# EAGLE design Breakout_14Pin (EAGLE 9.6.2)
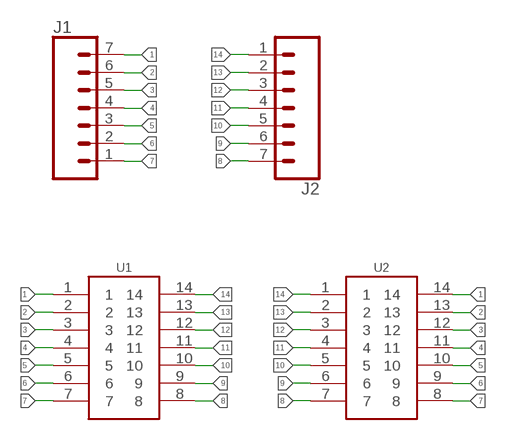
[diagram p0: schematic, sheet 1]

## Parts
J1  CONN_07  [1X07]
J2  CONN_07  [1X07]
U1  GEN_14SOIC  [SO14]
U2  GEN_14TSSOP  [TSSOP14]

## Nets
1: J1.7 U1.1 U2.14
2: J1.6 U1.2 U2.13
3: J1.5 U1.3 U2.12
4: J1.4 U1.4 U2.11
5: J1.3 U1.5 U2.10
6: J1.2 U1.6 U2.9
7: J1.1 U1.7 U2.8
8: J2.7 U1.8 U2.7
9: J2.6 U1.9 U2.6
10: J2.5 U1.10 U2.5
11: J2.4 U1.11 U2.4
12: J2.3 U1.12 U2.3
13: J2.2 U1.13 U2.2
14: J2.1 U1.14 U2.1

## Library data of the parts
J1 J2 = bschulz:CONN_07: Multi connection point. Often used as Generic Header-pin footprint for 0.1 inch spaced/style header connections On any of the 0.1 inch spaced packages, you can populate with these: Break Away Headers - Straight <https://www.sparkfun.com/products/116> (PRT-00116) Break Away Male Headers - Right Angle <https://www.sparkfun.com/products/553> (PRT-00553) Female Headers <https://www.sparkfun.com/products/115> (PRT-00115) Break Away Headers - Machine Pin <https://www.sparkfun.com/products/117> (PRT-00117) Break Away Female Headers - Swiss Machine Pin <https://www.sparkfun.com/products/743> (PRT-00743) For SCREWTERMINALS and SPRING TERMINALS visit here: Screw Terimnals on SparkFun.com <https://www.sparkfun.com/search/results?term=Screw+Terminals> (5mm/3.5mm/2.54mm spacing) This device is also useful as a general connection point to wire up your design to another part of your project. Our various solder wires solder well into these plated through hole pads. Hook-Up Wire - Assortment (Stranded, 22 AWG) <https://www.sparkfun.com/products/11375> (PRT-11375) Hook-Up Wire - Assortment (Solid Core, 22 AWG) <https://www.sparkfun.com/products/11367> (PRT-11367) View the entire wire category on our website here <https://www.sparkfun.com/categories/141> Special notes: Molex polarized connector foot print use with SKU : PRT-08231 with associated crimp pins and housings. 1MM SMD Version SKU: PRT-10208 NOTES ON THE VARIANTS LOCK and LOCK_LONGPADS... This footprint was designed to help hold the alignment of a through-hole component (i.e. 6-pin header) while soldering it into place. You may notice that each hole has been shifted either up or down by 0.005 of an inch from it's more standard position (which is a perfectly straight line). This slight alteration caused the pins (the squares in the middle) to touch the edges of the holes. Because they are alternating, it causes a "brace" to hold the component in place. 0.005 has proven to be the perfect amount of "off-center" position when using our standard breakaway headers. Although looks a little odd when you look at the bare footprint, once you have a header in there, the alteration is very hard to notice. Also,if you push a header all the way into place, it is covered up entirely on the bottom side.
U1 U2 = bschulz:GEN_14: Generic 14 Pin Package for Breakout Boards

## Board
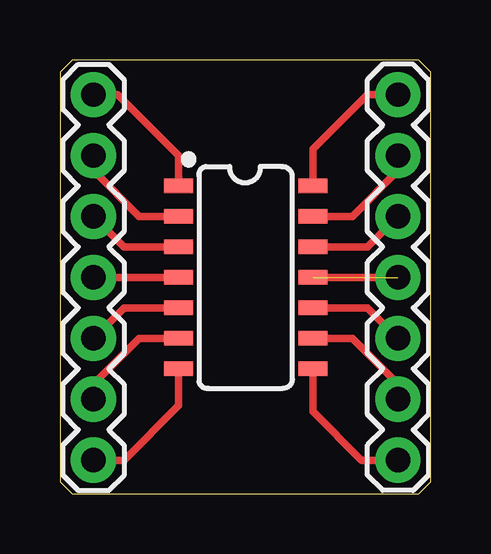
[diagram p1: board, top side]
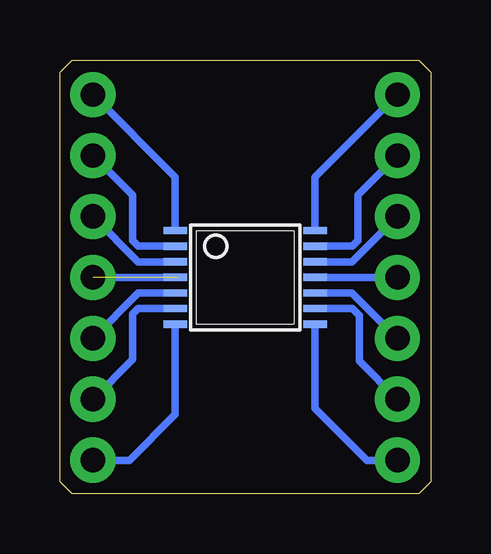
[diagram p2: board, bottom side, seen from below]

Size 15.47 x 18.09 mm. Coordinates in mm from the lower left corner, seen from the top.
Outline: 0,17.59 0,0.5 0.5,0 14.97,0 15.47,0.5 15.47,17.59 14.97,18.09 0.5,18.09 0,17.59
Copper layers (1*16): Top 0.035559375mm / dielectric 1.6mm / Bottom 0.035559375mm
Design rules "oshpark-2layer": minimum track width 6mil, minimum drill 10mil, track to track 6mil, track to pad 6mil, pad to pad 6mil, via to via 6mil, smd to smd 6mil, copper to edge 15mil, drill to drill 6mil, minimum pad ring 5mil, minimum via ring 5mil, stop-mask expansion 2.5mil, vias tented up to drill 0mil, thermal gap 10mil

### Footprints (pad centres in the part's own frame; a part is rotated, then mirrored left to right if it is on the bottom)
1X07 = drill 1.016 pad 1.88: 1 0,0; 2 2.54,0; 3 5.08,0; 4 7.62,0; 5 10.16,0; 6 12.7,0; 7 15.24,0
SO14 = smd 0.6 x 1.2: 1 -3.175,-2.8; 2 -1.905,-2.8; 3 -0.635,-2.8; 4 0.635,-2.8; 5 1.905,-2.8; 6 3.175,-2.8; 7 4.445,-2.8; 8 4.445,2.8; 9 3.175,2.8; 10 1.905,2.8; 11 0.635,2.8; 12 -0.635,2.8; 13 -1.905,2.8; 14 -3.175,2.8
TSSOP14 = smd 0.305 x 0.991: 1 -1.95,-2.918; 2 -1.3,-2.918; 3 -0.65,-2.918; 4 0,-2.918; 5 0.65,-2.918; 6 1.3,-2.918; 7 1.95,-2.918; 8 1.95,2.918; 9 1.3,2.918; 10 0.65,2.918; 11 0,2.918; 12 -0.65,2.918; 13 -1.3,2.918; 14 -1.95,2.918

### Placement (x,y rotation side)
J1  1.4,1.4 90 top
J2  14.1,16.64 270 top
U1  7.75,9.65 270 top
U2  7.75,9.02 270 bottom

### Tracks (layer width: path | path; a pad name or v marks a point on that pad's centre or on a via)
1
  Top 0.305: U1.1 4.95,14.1 2.41,16.64 J1.7
  Bottom 0.305: U2.14 4.83,13.21 J1.7
2
  Top 0.305: U1.2 3.3,11.56 1.4,13.46 J1.6
  Bottom 0.305: U2.13 3.28,10.32 3.05,10.55 3.05,12.44 J1.6
3
  Top 0.305: U1.3 2.67,10.29 J1.5
  Bottom 0.305: U2.12 3.29,9.67 J1.5
4
  Top 0.305: U1.4 J1.4
  Bottom 0.305: U2.11 J1.4
5
  Top 0.305: J1.3 2.67,7.75 U1.5
  Bottom 0.305: U2.10 3.29,8.37 J1.3
6
  Top 0.305: U1.6 3.3,6.48 1.4,4.57 J1.2
  Bottom 0.305: U2.9 3.28,7.72 2.99,7.42 2.99,5.53 J1.2
7
  Top 0.305: U1.7 4.95,3.68 2.67,1.4 J1.1
  Bottom 0.305: U2.8 4.83,3.56 2.67,1.4 J1.1
8
  Top 0.305: U1.8 10.55,3.42 12.57,1.4 J2.7
  Bottom 0.305: U2.7 10.66,3.31 12.57,1.4 J2.7
9
  Top 0.305: U1.9 12.19,6.48 14.1,4.57 J2.6
  Bottom 0.305: U2.6 12.21,7.72 12.44,7.49 12.44,5.59 J2.6
10
  Top 0.305: U1.10 12.83,7.75 J2.5
  Bottom 0.305: U2.5 12.21,8.37 J2.5
11  (4 unrouted)
  Top 0.305: U1.11 J2.4
  Bottom 0.305: U2.4 J2.4
12
  Top 0.305: U1.12 12.83,10.29 J2.3
  Bottom 0.305: U2.3 12.21,9.67 J2.3
13
  Top 0.305: U1.13 12.19,11.56 14.1,13.46 J2.2
  Bottom 0.305: U2.2 12.21,10.32 12.44,10.55 12.44,12.44 J2.2
14
  Top 0.305: U1.14 10.55,14.36 12.83,16.64 J2.1
  Bottom 0.305: U2.1 10.66,13.21 J2.1

### Text on the board
tDocu: 1 | 14 | SOIC 14 | 2 | 13 | 3 | 12 | 4 | 11 | 5 | 10 | 6 | 9 | Bobby Schulz / Break44 | 7 | 8
bDocu: 14 | 1 | SSOP-14 | 13 | 2 | 12 | 3 | 11 | 4 | 10 | 5 | 9 | 6 | 8 | 7